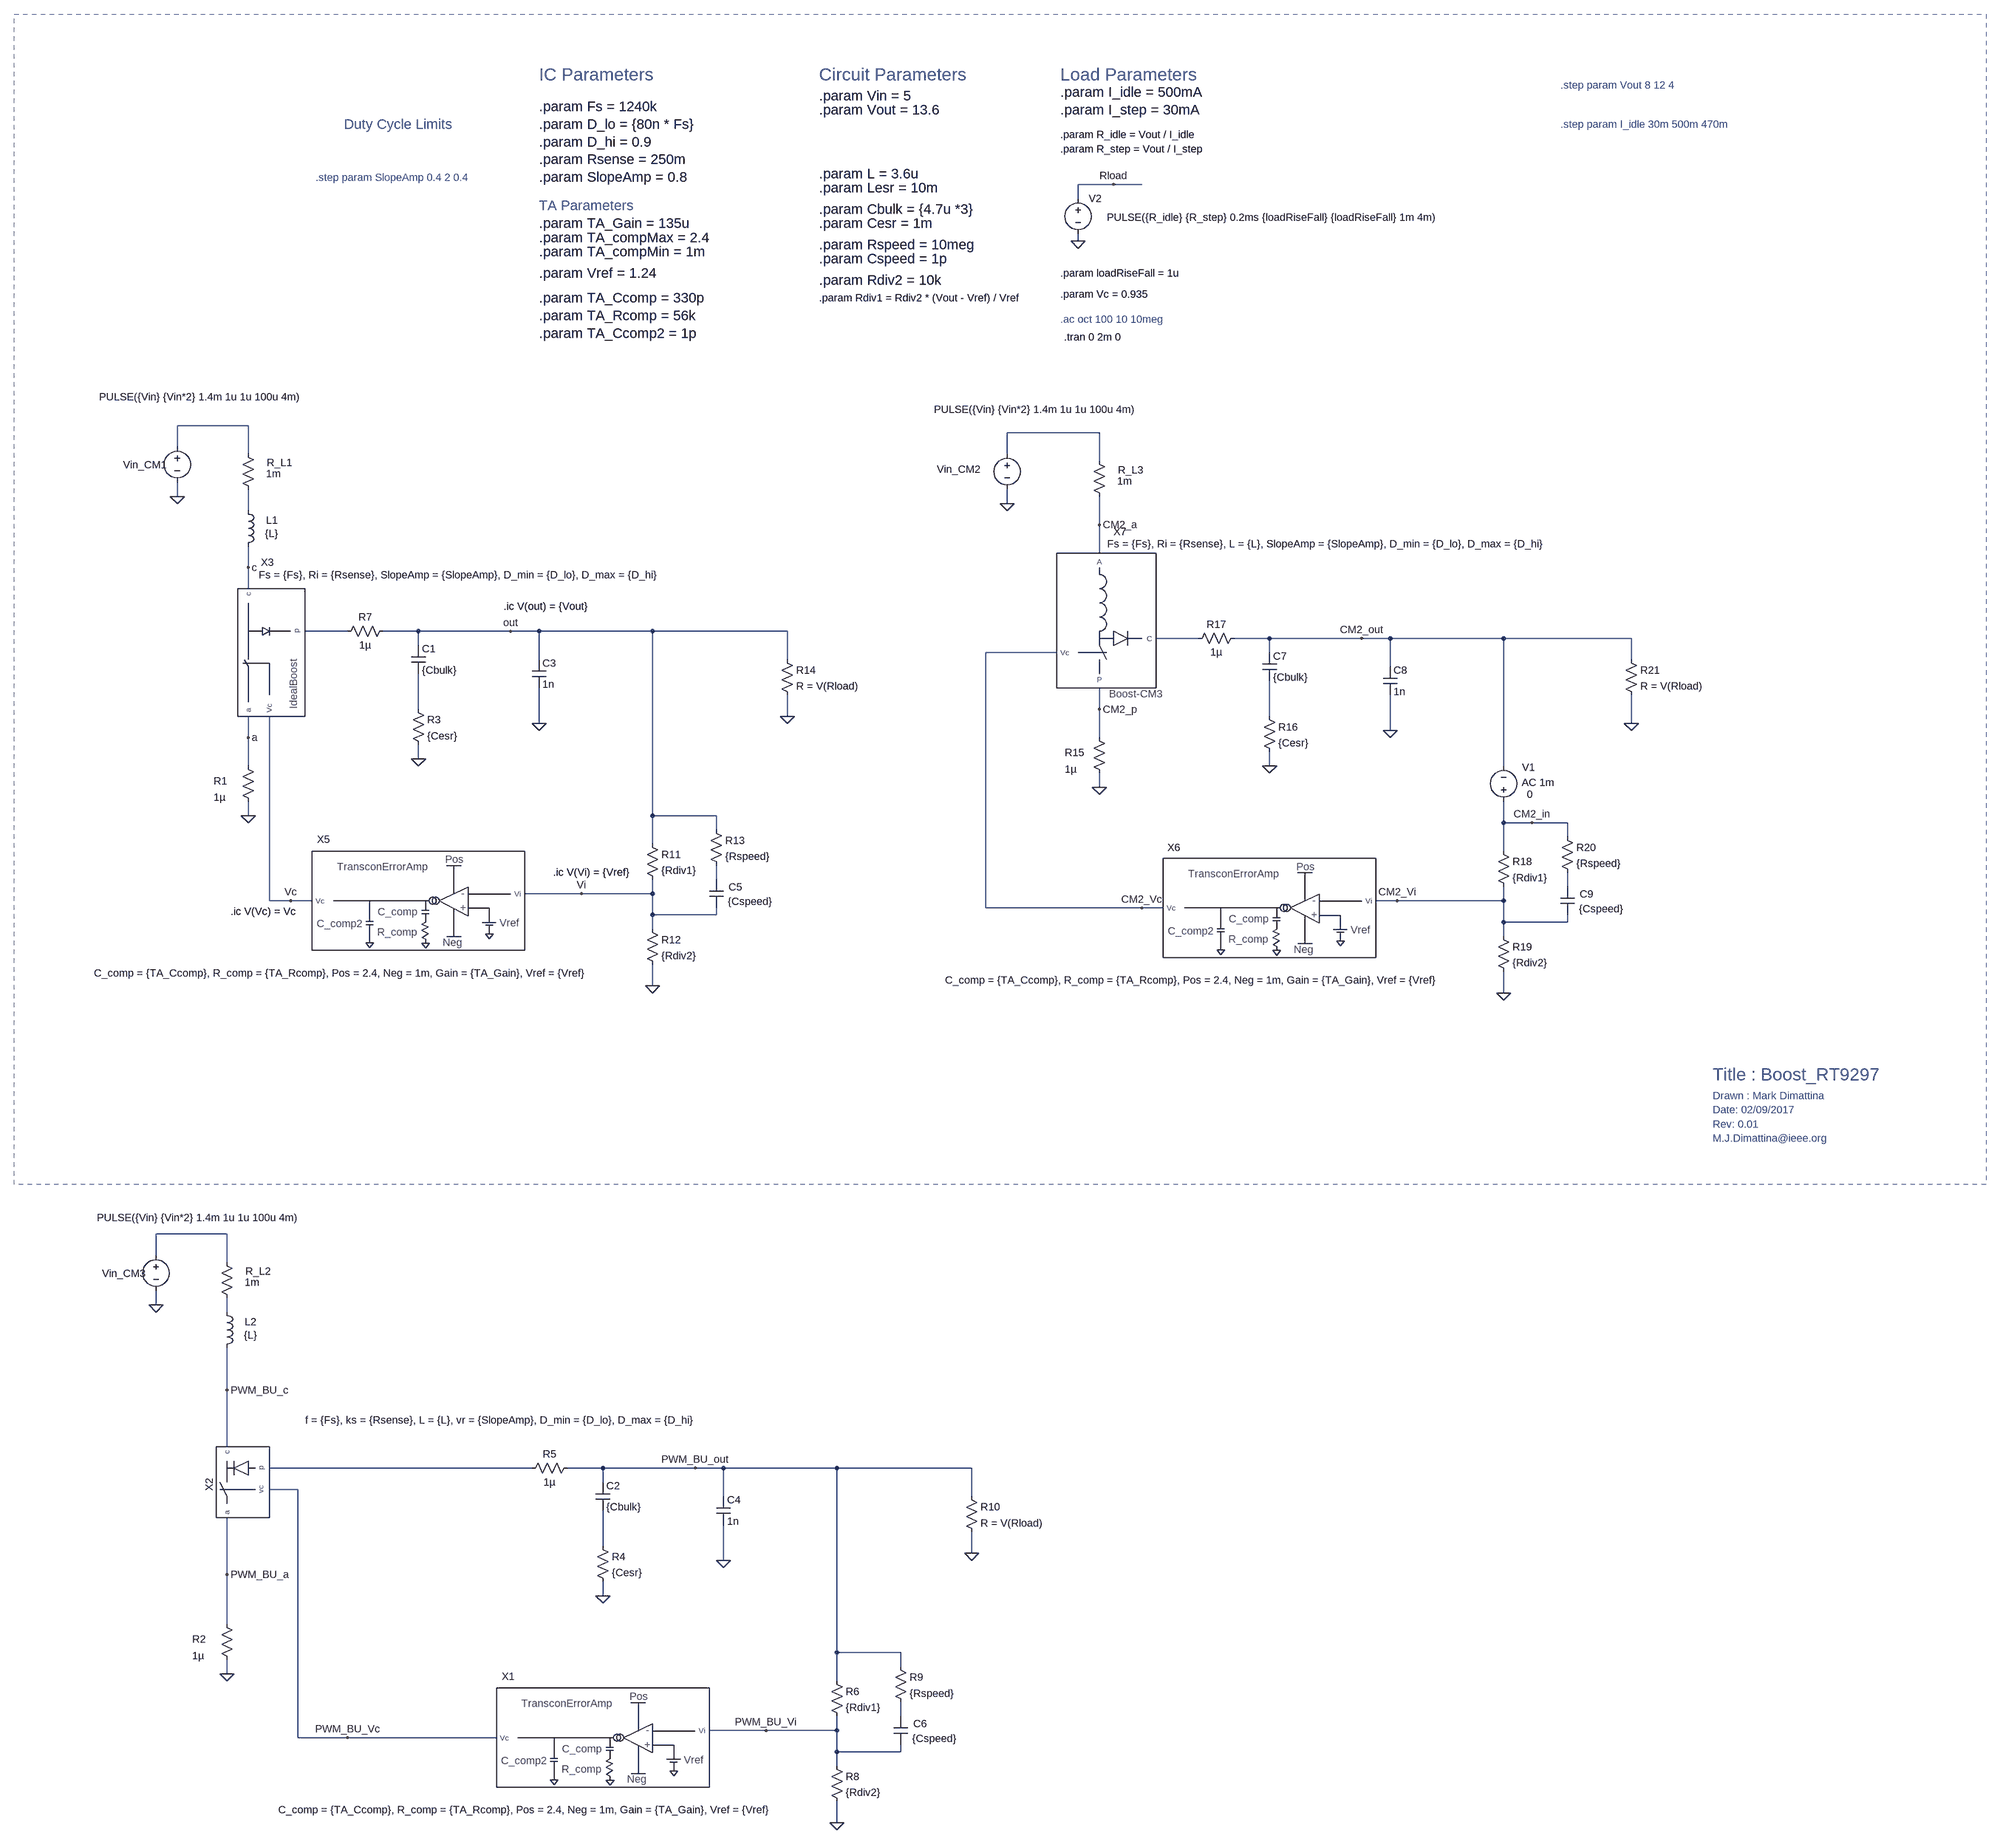
[diagram p0: schematic Boost_RT9297.asc]
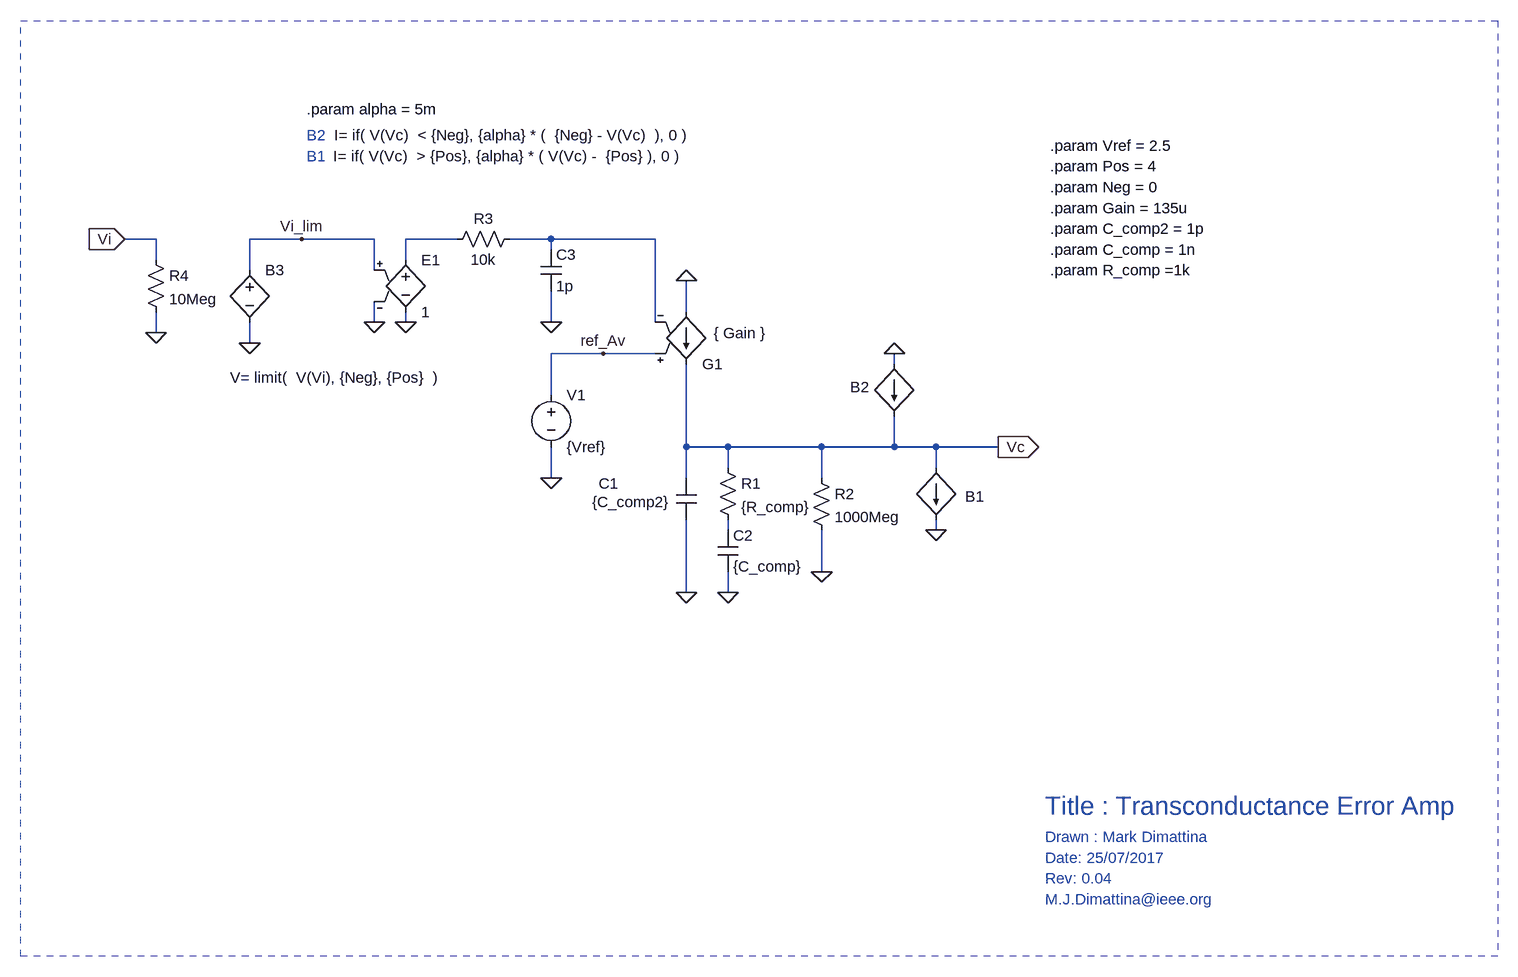
[diagram p1: sub-circuit transconerroramp.asc]
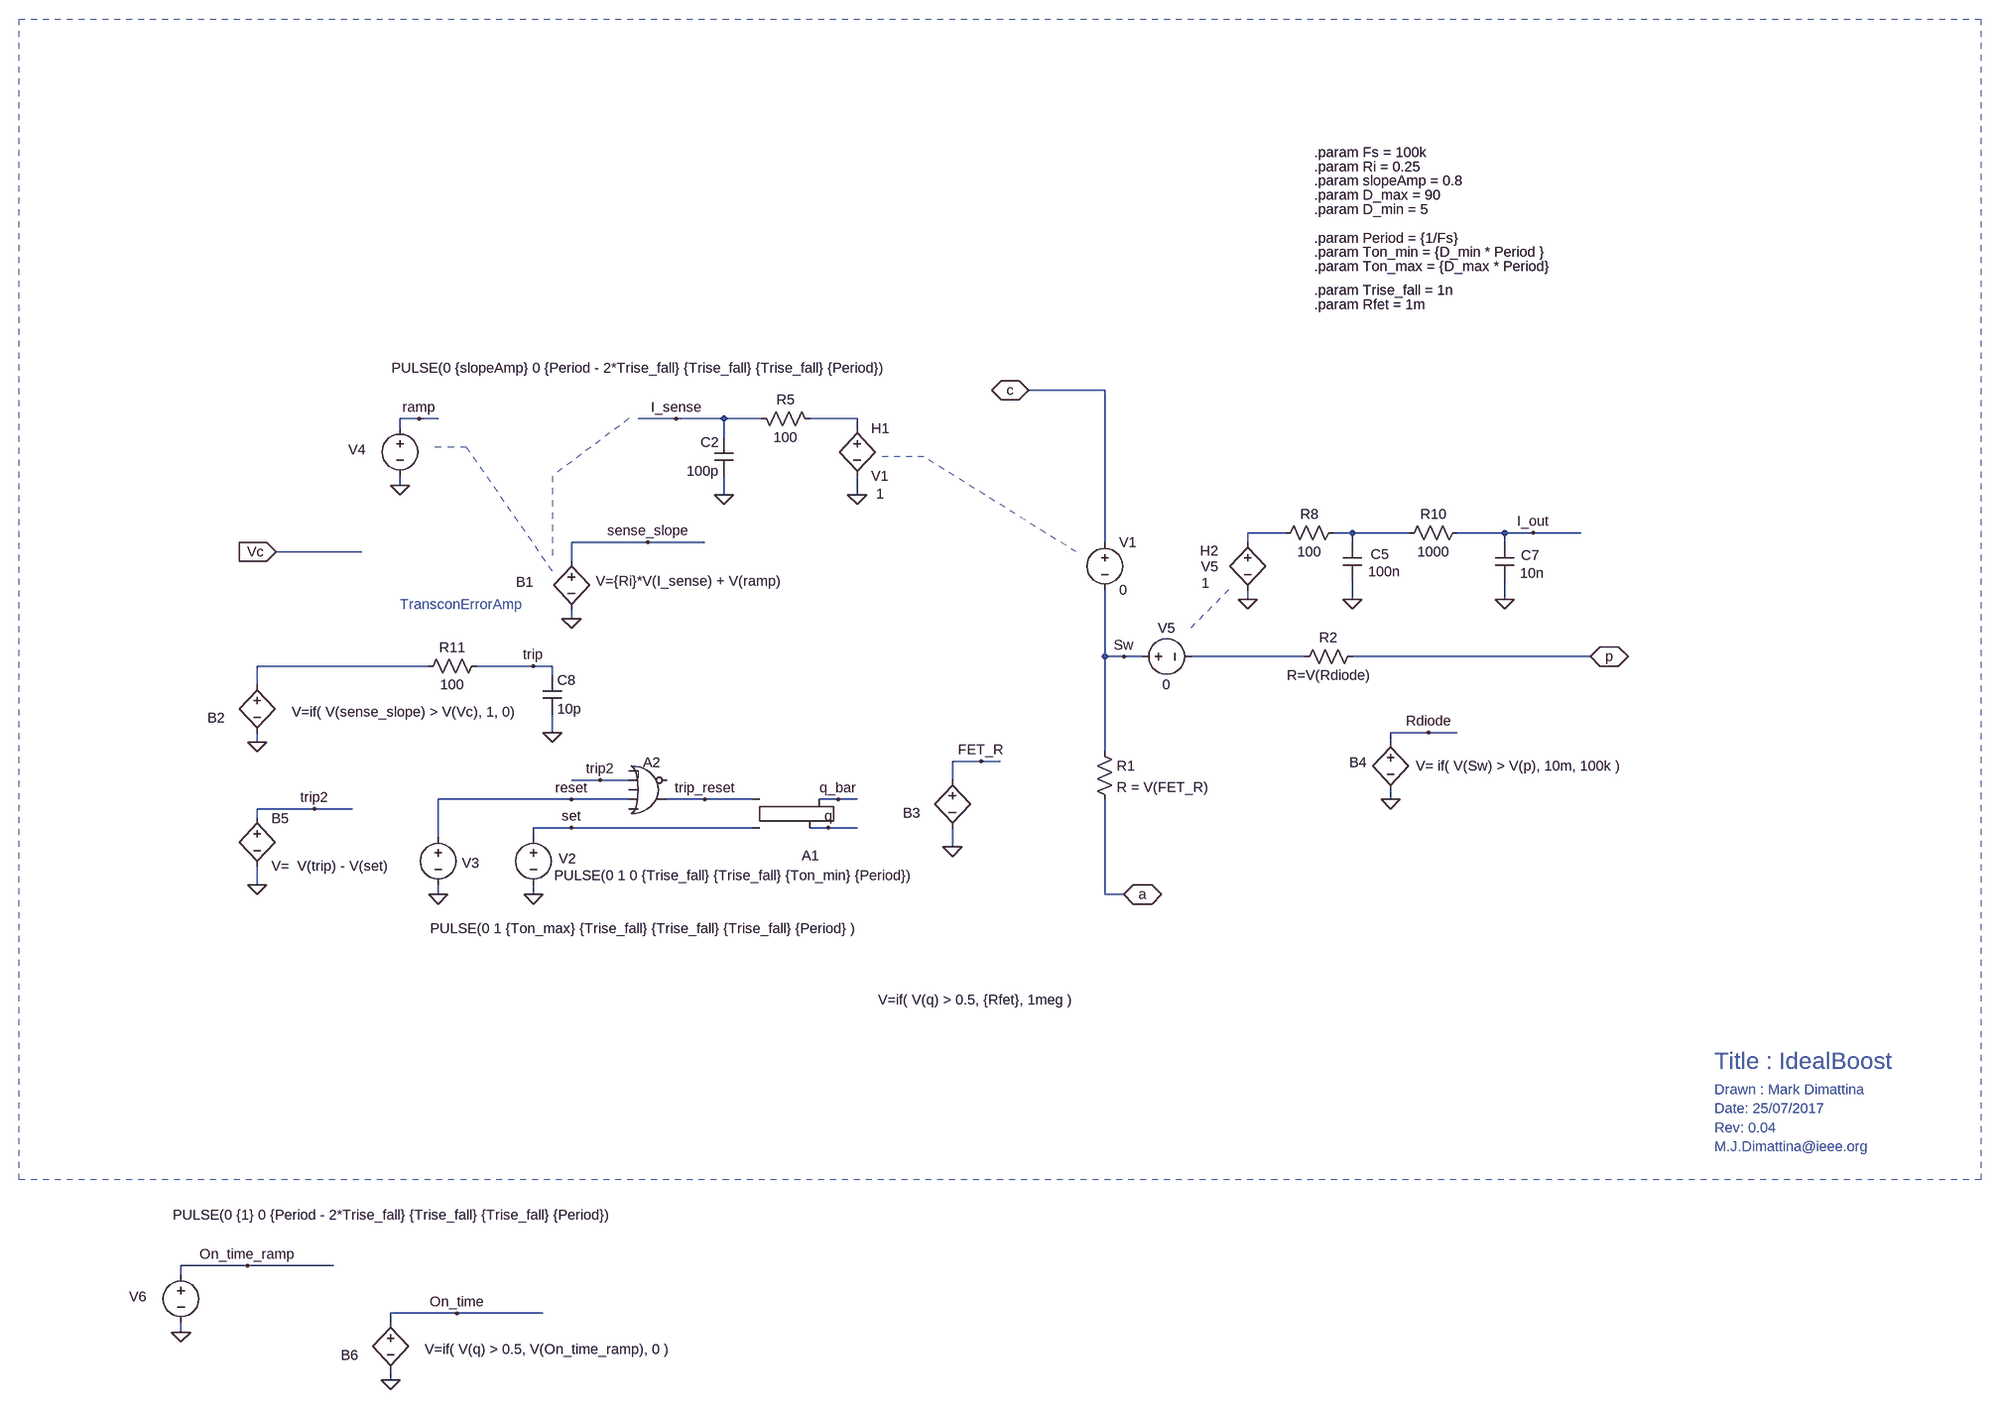
[diagram p2: sub-circuit idealboost.asc]
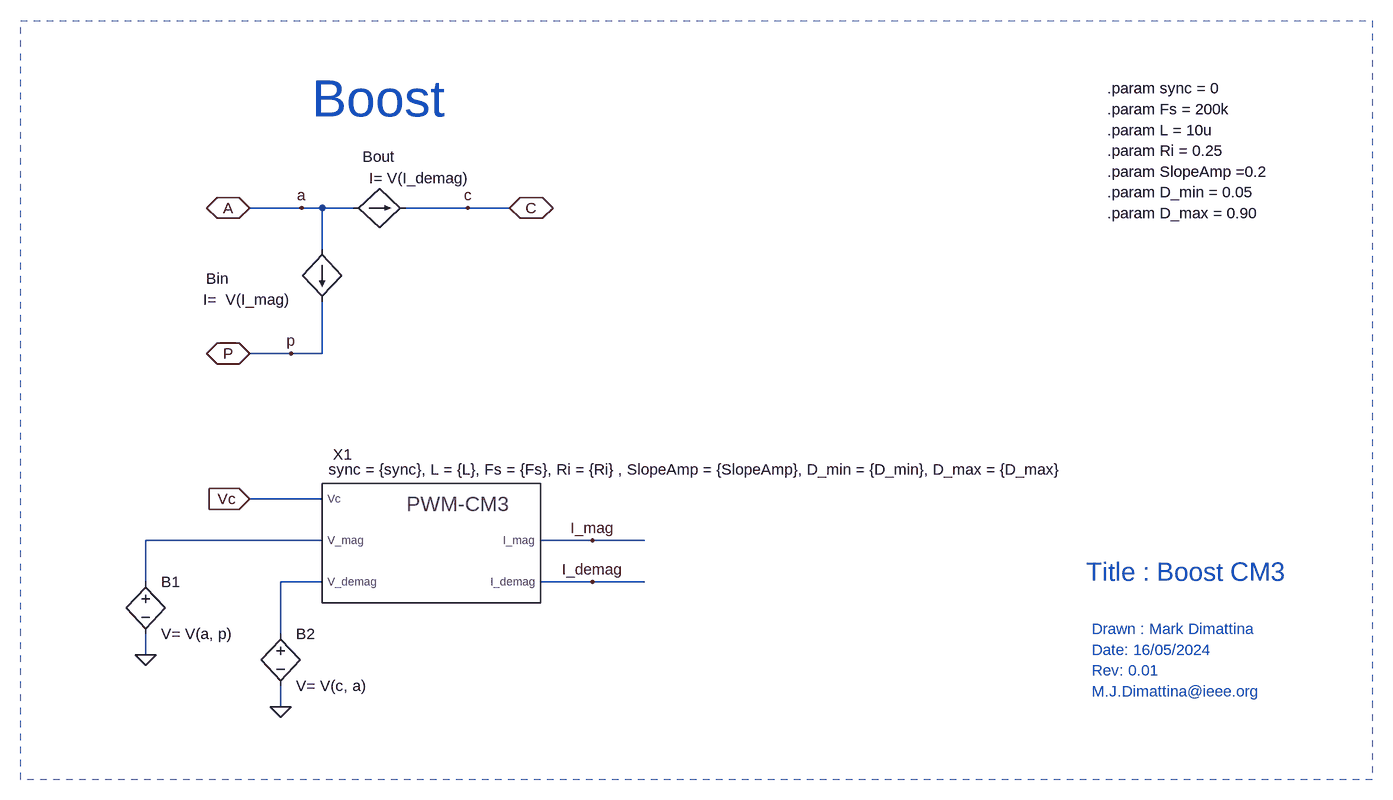
[diagram p3: sub-circuit boost_cm3.asc]
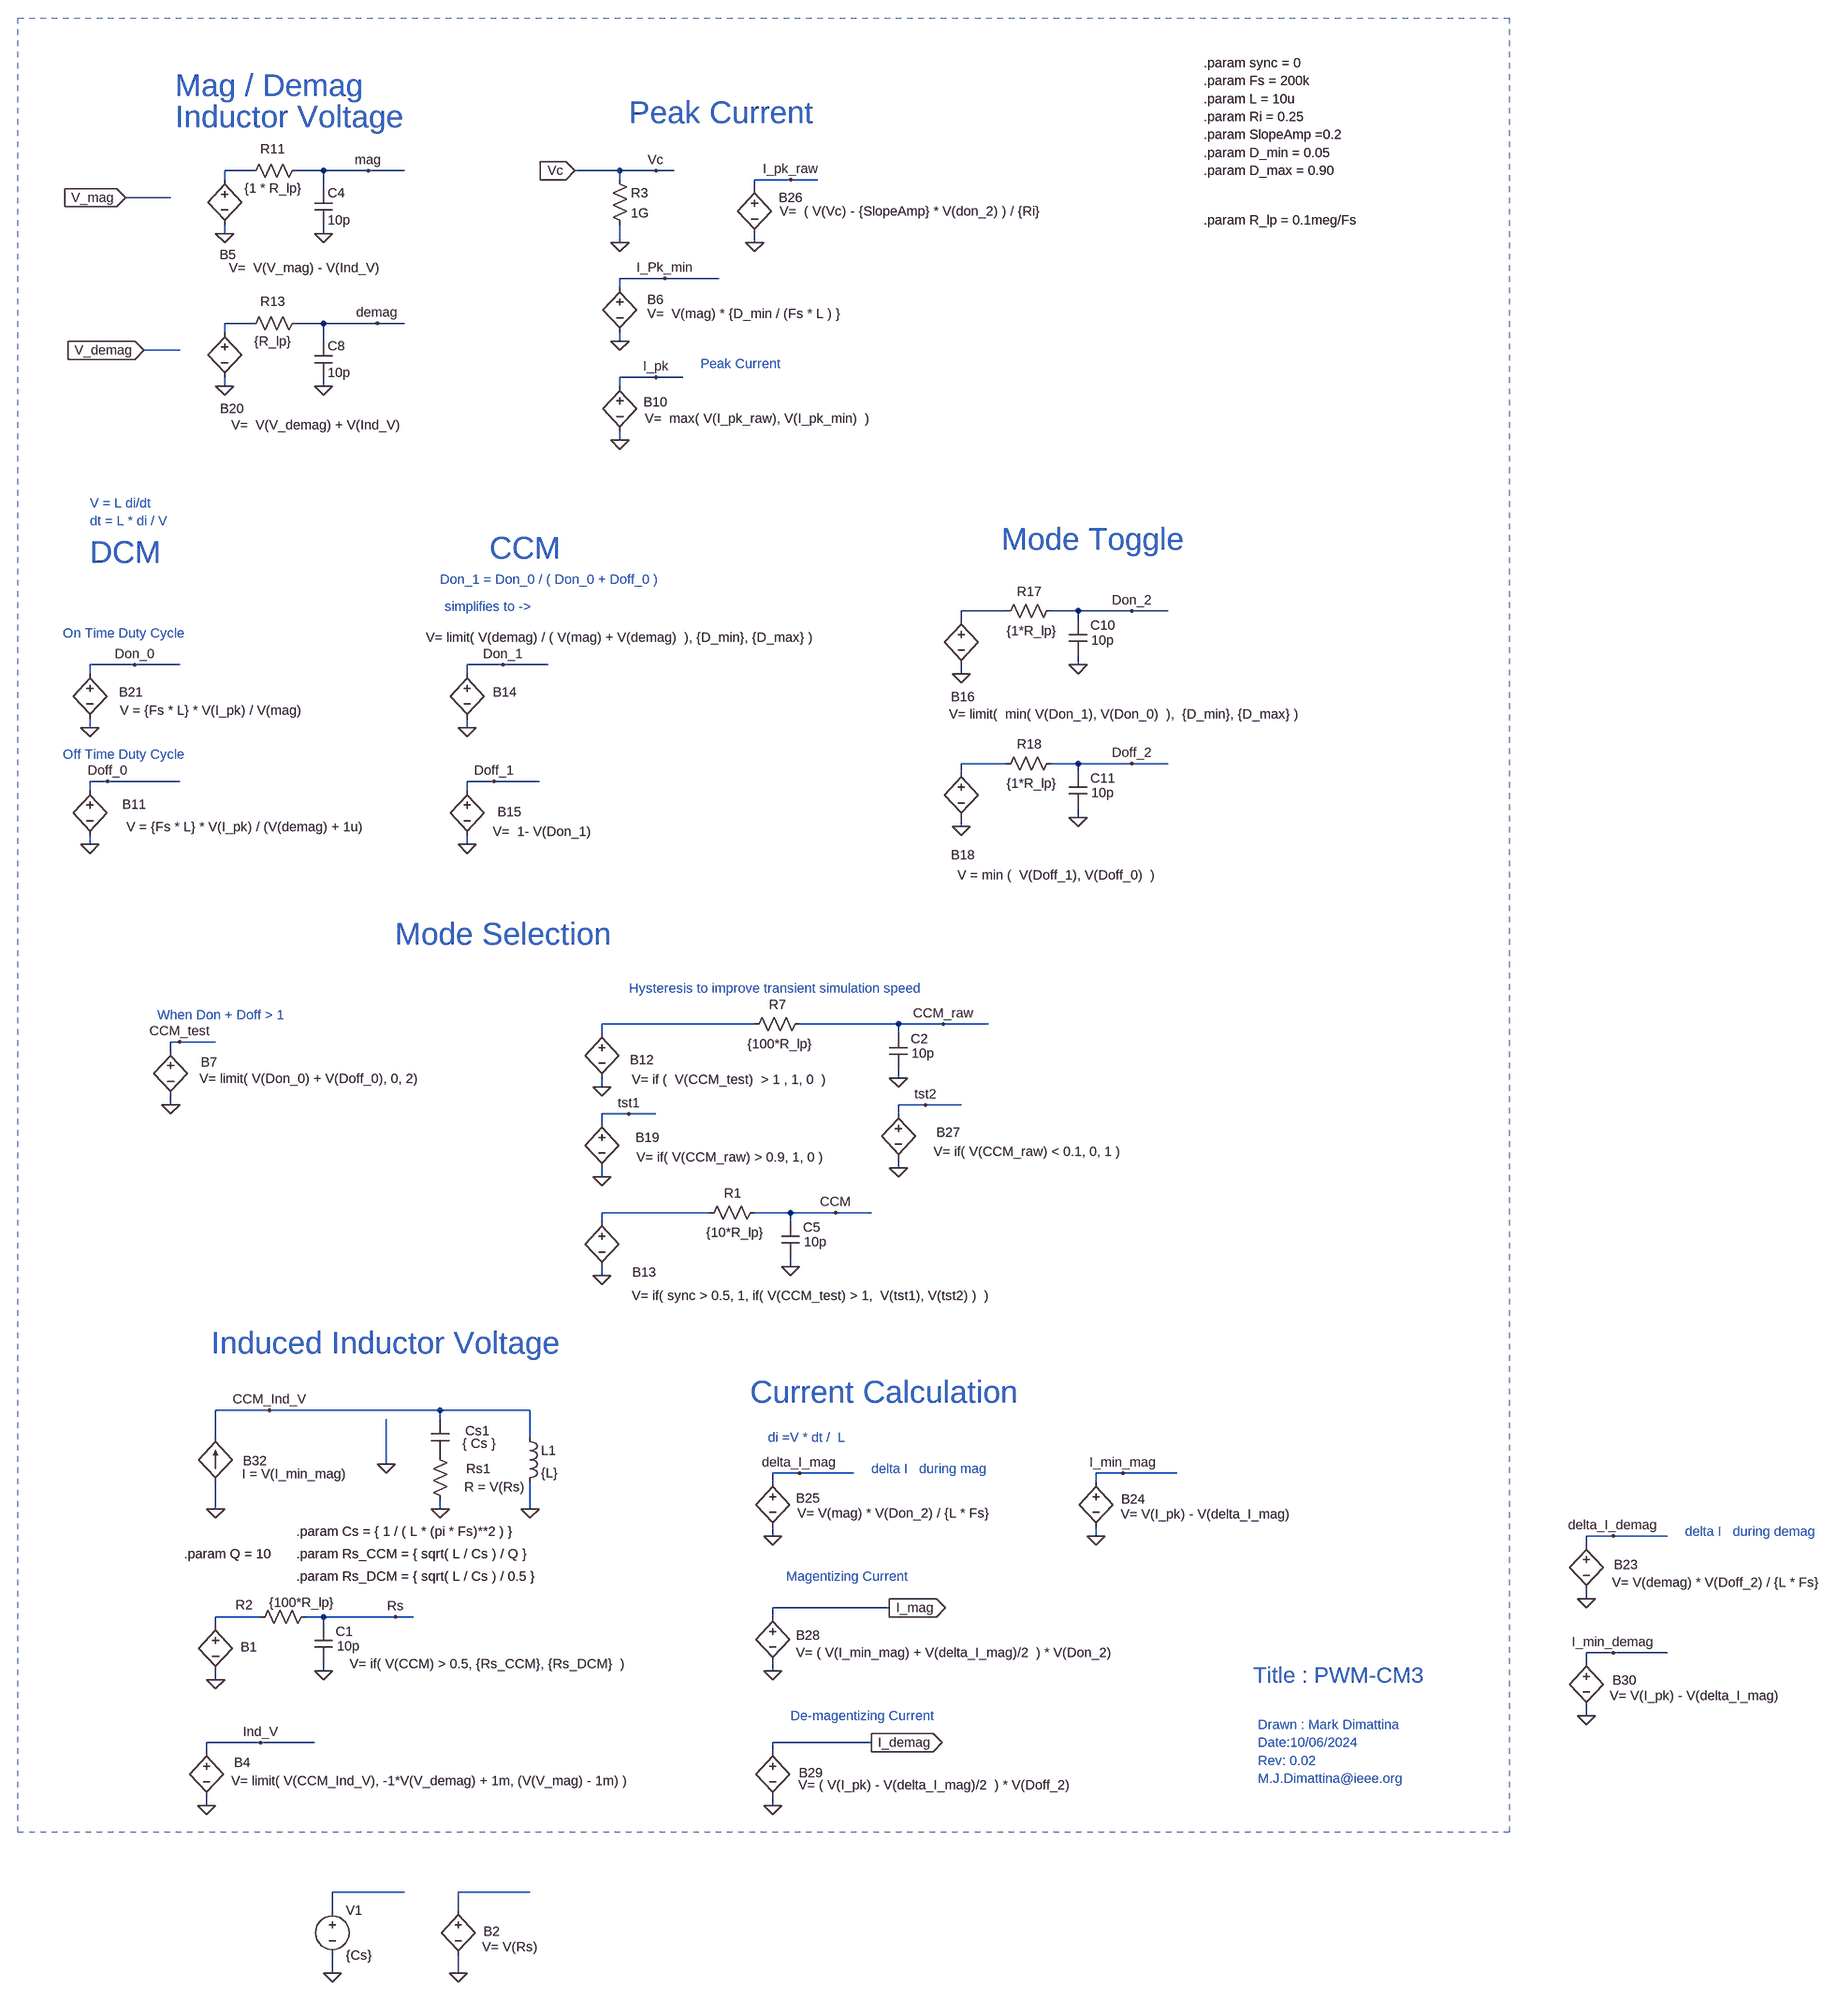
[diagram p4: sub-circuit pwm_cm3.asc]
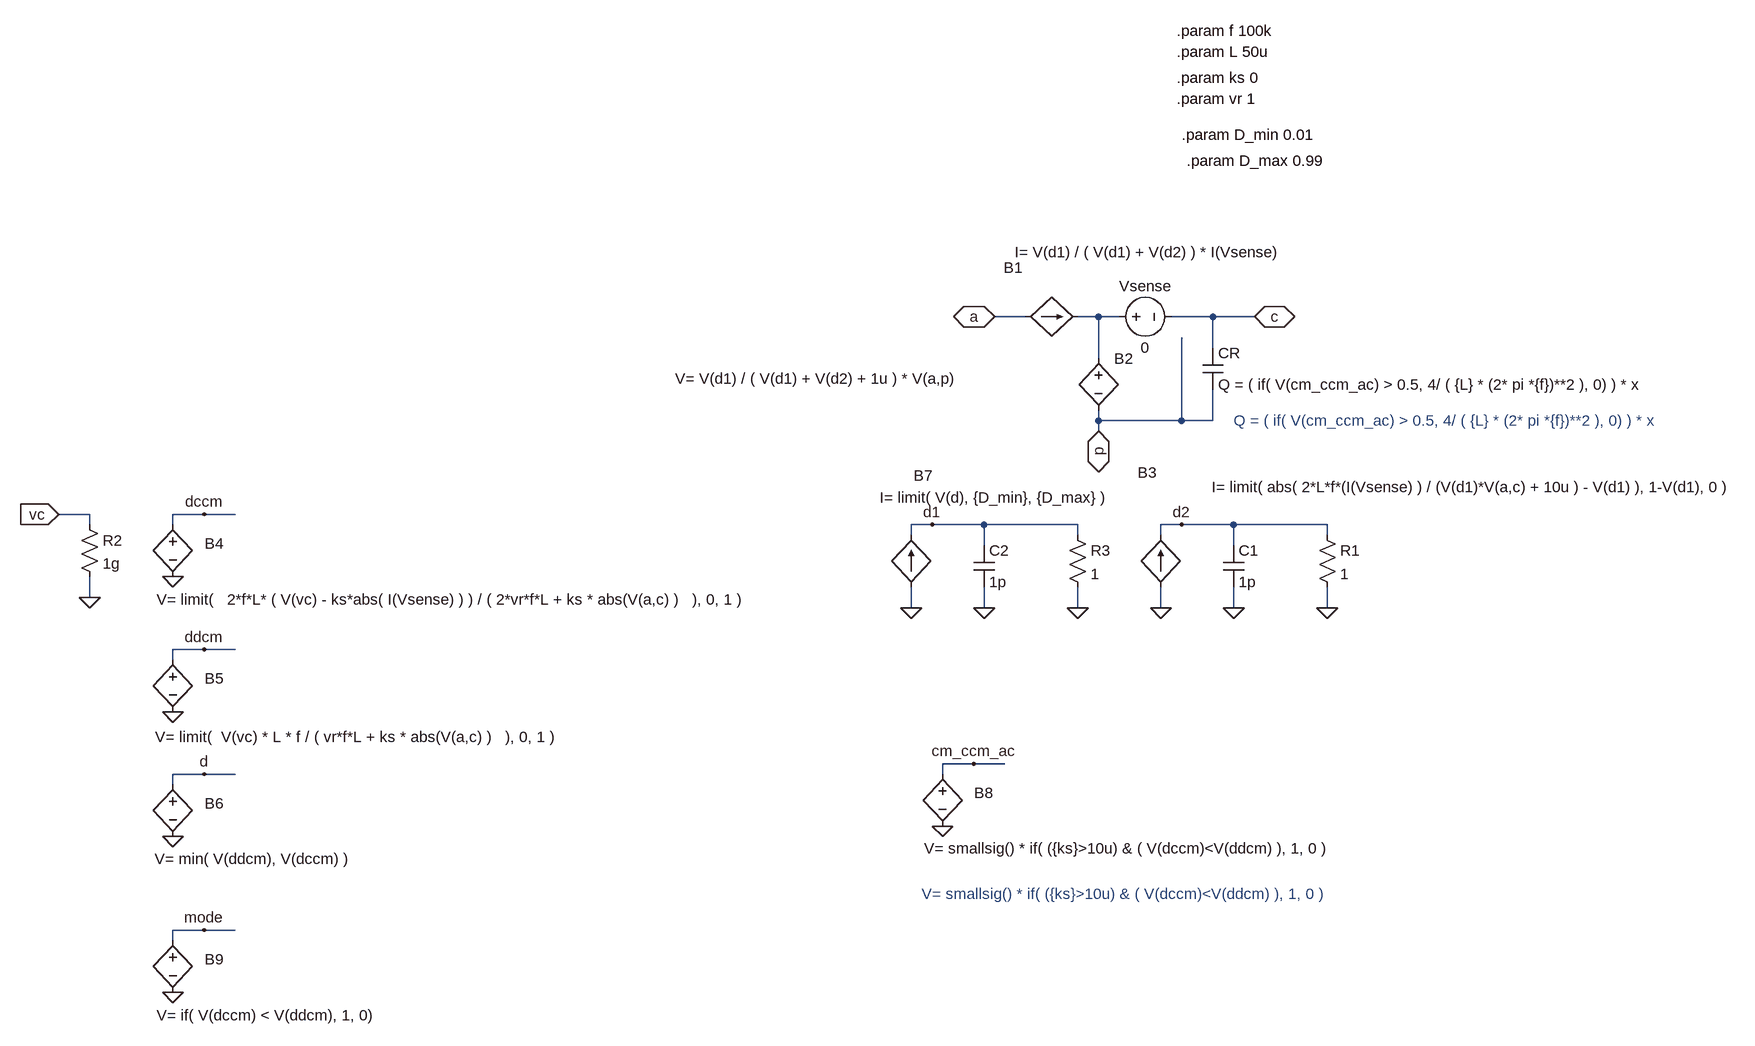
[diagram p5: sub-circuit pwm_bu.asc]
Boost_RT9297.asc, the LTspice schematic file:
Version 4
SHEET 1 4164 4132
WIRE 784 -416 704 -416
WIRE 848 -416 784 -416
WIRE 704 -384 704 -416
WIRE 704 -288 704 -304
WIRE -1168 128 -1328 128
WIRE 752 144 544 144
WIRE -1328 176 -1328 128
WIRE -1168 192 -1168 128
WIRE 544 192 544 144
WIRE 752 208 752 144
WIRE -1328 288 -1328 256
WIRE 544 304 544 272
WIRE -1168 320 -1168 272
WIRE 752 352 752 288
WIRE 752 416 752 352
WIRE -1168 448 -1168 400
WIRE -1168 496 -1168 448
WIRE -944 592 -1040 592
WIRE -784 592 -864 592
WIRE -576 592 -784 592
WIRE -512 592 -576 592
WIRE -256 592 -512 592
WIRE 48 592 -256 592
WIRE 976 608 880 608
WIRE 1136 608 1056 608
WIRE 1344 608 1136 608
WIRE 1408 608 1344 608
WIRE 1664 608 1408 608
WIRE 1952 608 1664 608
WIRE -784 624 -784 592
WIRE 656 640 496 640
WIRE 1136 640 1136 608
WIRE -512 656 -512 592
WIRE 48 656 48 592
WIRE 1952 656 1952 608
WIRE 1408 672 1408 608
WIRE -784 768 -784 688
WIRE 752 768 752 720
WIRE 48 784 48 736
WIRE 1136 784 1136 704
WIRE -512 800 -512 720
WIRE 1952 800 1952 736
WIRE 1408 816 1408 736
WIRE -1168 832 -1168 784
WIRE 752 832 752 768
WIRE -784 880 -784 848
WIRE -1168 896 -1168 832
WIRE 1136 896 1136 864
WIRE 1664 896 1664 608
WIRE 752 944 752 912
WIRE -1168 1008 -1168 976
WIRE -256 1008 -256 592
WIRE -112 1008 -256 1008
WIRE 1664 1024 1664 976
WIRE 1728 1024 1664 1024
WIRE 1808 1024 1728 1024
WIRE -112 1040 -112 1008
WIRE 1808 1056 1808 1024
WIRE -256 1072 -256 1008
WIRE 1664 1088 1664 1024
WIRE -112 1152 -112 1120
WIRE 1808 1168 1808 1136
WIRE -416 1184 -544 1184
WIRE -256 1184 -256 1152
WIRE -256 1184 -416 1184
WIRE -1120 1200 -1120 784
WIRE -1072 1200 -1120 1200
WIRE -1024 1200 -1072 1200
WIRE 1424 1200 1376 1200
WIRE 1664 1200 1664 1168
WIRE 1664 1200 1424 1200
WIRE 496 1216 496 640
WIRE 848 1216 496 1216
WIRE 896 1216 848 1216
WIRE -256 1232 -256 1184
WIRE -112 1232 -112 1216
WIRE -112 1232 -256 1232
WIRE 1664 1248 1664 1200
WIRE 1808 1248 1808 1232
WIRE 1808 1248 1664 1248
WIRE -256 1264 -256 1232
WIRE 1664 1280 1664 1248
WIRE -256 1392 -256 1344
WIRE 1664 1408 1664 1360
WIRE -1216 1952 -1376 1952
WIRE -1376 2000 -1376 1952
WIRE -1216 2016 -1216 1952
WIRE -1376 2112 -1376 2080
WIRE -1216 2128 -1216 2096
WIRE -1216 2304 -1216 2208
WIRE -1216 2432 -1216 2304
WIRE -528 2480 -1120 2480
WIRE -368 2480 -448 2480
WIRE -160 2480 -368 2480
WIRE -96 2480 -160 2480
WIRE 160 2480 -96 2480
WIRE 464 2480 160 2480
WIRE -368 2512 -368 2480
WIRE -1056 2528 -1120 2528
WIRE -96 2544 -96 2480
WIRE 464 2544 464 2480
WIRE -368 2656 -368 2576
WIRE 464 2672 464 2624
WIRE -96 2688 -96 2608
WIRE -1216 2720 -1216 2592
WIRE -368 2768 -368 2736
WIRE -1216 2832 -1216 2720
WIRE 160 2896 160 2480
WIRE 304 2896 160 2896
WIRE 304 2928 304 2896
WIRE -1216 2944 -1216 2912
WIRE 160 2960 160 2896
WIRE 304 3040 304 3008
WIRE 0 3072 -128 3072
WIRE 160 3072 160 3040
WIRE 160 3072 0 3072
WIRE -1056 3088 -1056 2528
WIRE -944 3088 -1056 3088
WIRE -608 3088 -944 3088
WIRE 160 3120 160 3072
WIRE 304 3120 304 3104
WIRE 304 3120 160 3120
WIRE 160 3152 160 3120
WIRE 160 3280 160 3232
FLAG 704 -288 0
FLAG 784 -416 Rload
FLAG -576 592 out
FLAG -1168 1008 0
FLAG -1072 1200 Vc
FLAG -1328 288 0
FLAG -784 880 0
FLAG -1168 832 a
FLAG -1168 448 c
FLAG -512 800 0
FLAG -256 1392 0
FLAG 48 784 0
FLAG -416 1184 Vi
FLAG 1344 608 CM2_out
FLAG 752 944 0
FLAG 848 1216 CM2_Vc
FLAG 544 304 0
FLAG 1136 896 0
FLAG 752 768 CM2_p
FLAG 752 352 CM2_a
FLAG 1408 816 0
FLAG 1664 1408 0
FLAG 1728 1024 CM2_in
FLAG 1952 800 0
FLAG 1424 1200 CM2_Vi
FLAG -160 2480 PWM_BU_out
FLAG -1216 2944 0
FLAG -944 3088 PWM_BU_Vc
FLAG -1376 2112 0
FLAG -368 2768 0
FLAG -1216 2720 PWM_BU_a
FLAG -1216 2304 PWM_BU_c
FLAG -96 2688 0
FLAG 160 3280 0
FLAG 464 2672 0
FLAG 0 3072 PWM_BU_Vi
DATAFLAG 624 1216 ""
DATAFLAG 1792 608 ""
DATAFLAG -736 3088 ""
DATAFLAG 48 2480 ""
SYMBOL voltage 704 -400 R0
WINDOW 3 65 58 Left 2
WINDOW 123 0 0 Left 2
WINDOW 39 0 0 Left 2
SYMATTR Value PULSE({R_idle} {R_step} 0.2ms {loadRiseFall} {loadRiseFall} 1m 4m)
SYMATTR InstName V2
SYMBOL res -1184 880 R0
WINDOW 0 -62 50 Left 2
WINDOW 3 -62 87 Left 2
SYMATTR InstName R1
SYMATTR Value 1µ
SYMBOL ind -1184 304 R0
WINDOW 0 56 38 Left 2
WINDOW 3 54 68 Left 2
SYMATTR InstName L1
SYMATTR Value {L}
SYMBOL res -1184 176 R0
WINDOW 0 58 36 Left 2
WINDOW 3 56 61 Left 2
SYMATTR InstName R_L1
SYMATTR Value 1m
SYMBOL voltage -1328 160 R0
WINDOW 0 -122 57 Left 2
WINDOW 3 -176 -97 Left 2
WINDOW 123 0 0 Left 0
WINDOW 39 0 0 Left 0
SYMATTR InstName Vin_CM1
SYMATTR Value PULSE({Vin} {Vin*2} 1.4m 1u 1u 100u 4m)
SYMBOL cap -800 624 R0
SYMATTR InstName C1
SYMATTR Value {Cbulk}
SYMBOL res -800 752 R0
SYMATTR InstName R3
SYMATTR Value {Cesr}
SYMBOL res -960 608 R270
WINDOW 0 32 56 VTop 2
WINDOW 3 0 56 VBottom 2
SYMATTR InstName R7
SYMATTR Value 1µ
SYMBOL cap -528 656 R0
SYMATTR InstName C3
SYMATTR Value 1n
SYMBOL res -272 1056 R0
SYMATTR InstName R11
SYMATTR Value {Rdiv1}
SYMBOL res -272 1248 R0
SYMATTR InstName R12
SYMATTR Value {Rdiv2}
SYMBOL res -128 1024 R0
SYMATTR InstName R13
SYMATTR Value {Rspeed}
SYMBOL cap -128 1152 R0
WINDOW 0 44 17 Left 2
WINDOW 3 42 50 Left 2
SYMATTR InstName C5
SYMATTR Value {Cspeed}
SYMBOL res 32 640 R0
SYMATTR InstName R14
SYMATTR Value R = V(Rload)
SYMBOL TransconErrorAmp -640 1120 M0
WINDOW 0 343 -58 Left 2
WINDOW 39 -233 243 Left 2
SYMATTR InstName X5
SYMATTR SpiceLine C_comp = {TA_Ccomp}, R_comp = {TA_Rcomp}, Pos = 2.4, Neg = 1m, Gain = {TA_Gain}, Vref = {Vref}
SYMBOL IdealBoost -1136 688 R270
WINDOW 39 223 -8 VRight 2
WINDOW 0 236 11 VTop 2
SYMATTR SpiceLine Fs = {Fs}, Ri = {Rsense}, SlopeAmp = {SlopeAmp}, D_min = {D_lo}, D_max = {D_hi}
SYMATTR InstName X3
SYMBOL res 736 816 R0
WINDOW 0 -62 50 Left 2
WINDOW 3 -62 87 Left 2
SYMATTR InstName R15
SYMATTR Value 1µ
SYMBOL res 736 192 R0
WINDOW 0 58 36 Left 2
WINDOW 3 56 61 Left 2
SYMATTR InstName R_L3
SYMATTR Value 1m
SYMBOL voltage 544 176 R0
WINDOW 0 -158 51 Left 2
WINDOW 3 -165 -84 Left 2
SYMATTR InstName Vin_CM2
SYMATTR Value PULSE({Vin} {Vin*2} 1.4m 1u 1u 100u 4m)
SYMBOL cap 1120 640 R0
SYMATTR InstName C7
SYMATTR Value {Cbulk}
SYMBOL res 1120 768 R0
SYMATTR InstName R16
SYMATTR Value {Cesr}
SYMBOL res 960 624 R270
WINDOW 0 32 56 VTop 2
WINDOW 3 0 56 VBottom 2
SYMATTR InstName R17
SYMATTR Value 1µ
SYMBOL cap 1392 672 R0
SYMATTR InstName C8
SYMATTR Value 1n
SYMBOL res 1648 1072 R0
SYMATTR InstName R18
SYMATTR Value {Rdiv1}
SYMBOL res 1648 1264 R0
SYMATTR InstName R19
SYMATTR Value {Rdiv2}
SYMBOL res 1792 1040 R0
SYMATTR InstName R20
SYMATTR Value {Rspeed}
SYMBOL cap 1792 1168 R0
WINDOW 0 44 17 Left 2
WINDOW 3 42 50 Left 2
SYMATTR InstName C9
SYMATTR Value {Cspeed}
SYMBOL voltage 1664 992 R180
WINDOW 0 -71 93 Left 2
WINDOW 3 -66 32 Left 2
WINDOW 123 -114 59 Left 2
WINDOW 39 0 0 Left 2
SYMATTR InstName V1
SYMATTR Value 0
SYMATTR Value2 AC 1m
SYMBOL res 1936 640 R0
SYMATTR InstName R21
SYMATTR Value R = V(Rload)
SYMBOL TransconErrorAmp 1280 1136 M0
WINDOW 0 345 -56 Left 2
WINDOW 39 -233 243 Left 2
SYMATTR InstName X6
SYMATTR SpiceLine C_comp = {TA_Ccomp}, R_comp = {TA_Rcomp}, Pos = 2.4, Neg = 1m, Gain = {TA_Gain}, Vref = {Vref}
SYMBOL Boost_CM3 688 496 R0
WINDOW 0 111 -113 Bottom 2
WINDOW 39 82 -101 Left 2
SYMATTR InstName X7
SYMATTR SpiceLine Fs = {Fs}, Ri = {Rsense}, L = {L}, SlopeAmp = {SlopeAmp}, D_min = {D_lo}, D_max = {D_hi}
SYMBOL res -1232 2816 R0
WINDOW 0 -62 50 Left 2
WINDOW 3 -62 87 Left 2
SYMATTR InstName R2
SYMATTR Value 1µ
SYMBOL ind -1232 2112 R0
WINDOW 0 56 38 Left 2
WINDOW 3 54 68 Left 2
SYMATTR InstName L2
SYMATTR Value {L}
SYMBOL res -1232 2000 R0
WINDOW 0 58 36 Left 2
WINDOW 3 56 61 Left 2
SYMATTR InstName R_L2
SYMATTR Value 1m
SYMBOL voltage -1376 1984 R0
WINDOW 0 -122 57 Left 2
WINDOW 3 -133 -69 Left 2
SYMATTR InstName Vin_CM3
SYMATTR Value PULSE({Vin} {Vin*2} 1.4m 1u 1u 100u 4m)
SYMBOL cap -384 2512 R0
SYMATTR InstName C2
SYMATTR Value {Cbulk}
SYMBOL res -384 2640 R0
SYMATTR InstName R4
SYMATTR Value {Cesr}
SYMBOL res -544 2496 R270
WINDOW 0 32 56 VTop 2
WINDOW 3 0 56 VBottom 2
SYMATTR InstName R5
SYMATTR Value 1µ
SYMBOL cap -112 2544 R0
SYMATTR InstName C4
SYMATTR Value 1n
SYMBOL res 144 2944 R0
SYMATTR InstName R6
SYMATTR Value {Rdiv1}
SYMBOL res 144 3136 R0
SYMATTR InstName R8
SYMATTR Value {Rdiv2}
SYMBOL res 288 2912 R0
SYMATTR InstName R9
SYMATTR Value {Rspeed}
SYMBOL cap 288 3040 R0
WINDOW 0 44 17 Left 2
WINDOW 3 42 50 Left 2
SYMATTR InstName C6
SYMATTR Value {Cspeed}
SYMBOL res 448 2528 R0
SYMATTR InstName R10
SYMATTR Value R = V(Rload)
SYMBOL TransconErrorAmp -224 3008 M0
WINDOW 0 343 -58 Left 2
WINDOW 39 -233 243 Left 2
SYMATTR InstName X1
SYMATTR SpiceLine C_comp = {TA_Ccomp}, R_comp = {TA_Rcomp}, Pos = 2.4, Neg = 1m, Gain = {TA_Gain}, Vref = {Vref}
SYMBOL PWM_BU -1184 2544 R270
WINDOW 39 157 583 VTop 2
SYMATTR InstName X2
SYMATTR SpiceLine f = {Fs}, ks = {Rsense}, L = {L}, vr = {SlopeAmp}, D_min = {D_lo}, D_max = {D_hi}
TEXT 664 -112 Left 2 ;.ac oct 100 10 10meg
TEXT 120 -440 Left 3 !.param L = 3.6u
TEXT -512 -592 Left 3 !.param Fs = 1240k
TEXT -512 -552 Left 3 !.param D_lo = {80n * Fs}
TEXT -512 -512 Left 3 !.param D_hi = 0.9
TEXT -512 -432 Left 3 !.param SlopeAmp = 0.8
TEXT -704 -552 Right 3 ;Duty Cycle Limits
TEXT -512 -664 Left 4 ;IC Parameters
TEXT 120 -584 Left 3 !.param Vout = 13.6
TEXT 120 -360 Left 3 !.param Cbulk = {4.7u *3}
TEXT 120 -328 Left 3 !.param Cesr = 1m
TEXT 120 -616 Left 3 !.param Vin = 5
TEXT 120 -408 Left 3 !.param Lesr = 10m
TEXT -512 -472 Left 3 !.param Rsense = 250m
TEXT 120 -200 Left 3 !.param Rdiv2 = 10k
TEXT 120 -160 Left 2 !.param Rdiv1 = Rdiv2 * (Vout - Vref) / Vref
TEXT -512 -216 Left 3 !.param Vref = 1.24
TEXT -512 -368 Left 3 ;TA Parameters
TEXT -512 -120 Left 3 !.param TA_Rcomp = 56k
TEXT -512 -160 Left 3 !.param TA_Ccomp = 330p
TEXT -512 -80 Left 3 !.param TA_Ccomp2 = 1p
TEXT -512 -328 Left 3 !.param TA_Gain = 135u
TEXT -512 -296 Left 3 !.param TA_compMax = 2.4
TEXT -512 -264 Left 3 !.param TA_compMin = 1m
TEXT 664 -584 Left 3 !.param I_step = 30mA
TEXT 664 -624 Left 3 !.param I_idle = 500mA
TEXT 664 -528 Left 2 !.param R_idle = Vout / I_idle
TEXT 664 -216 Left 2 !.param loadRiseFall = 1u
TEXT 120 -280 Left 3 !.param Rspeed = 10meg
TEXT 120 -248 Left 3 !.param Cspeed = 1p
TEXT 664 -168 Left 2 !.param Vc = 0.935
TEXT 120 -664 Left 4 ;Circuit Parameters
TEXT 664 -496 Left 2 !.param R_step = Vout / I_step
TEXT -592 536 Left 2 !.ic V(out) = {Vout}
TEXT -480 1136 Left 2 !.ic V(Vi) = {Vref}
TEXT 664 -664 Left 4 ;Load Parameters
TEXT -1208 1224 Left 2 !.ic V(Vc) = Vc
TEXT 1792 -640 Left 2 ;.step param Vout 8 12 4
TEXT 1792 -552 Left 2 ;.step param I_idle 30m 500m 470m
TEXT 2136 1640 Left 2 ;Drawn : Mark Dimattina
TEXT 2136 1592 Left 4 ;Title : Boost_RT9297
TEXT 2136 1704 Left 2 ;Rev: 0.01
TEXT 2136 1672 Left 2 ;Date: 02/09/2017
TEXT 2136 1736 Left 2 ;M.J.Dimattina@ieee.org
TEXT -1016 -432 Left 2 ;.step param SlopeAmp 0.4 2 0.4
TEXT 672 -72 Left 2 !.tran 0 2m 0
RECTANGLE Normal 2752 1840 -1696 -800 2

The netlist it stands for:
* Boost_RT9297.asc
V2 Rload 0 PULSE({R_idle} {R_step} 0.2ms {loadRiseFall} {loadRiseFall} 1m 4m)
R1 a 0 1µ
L1 N003 c {L}
R_L1 N001 N003 1m
Vin_CM1 N001 0 PULSE({Vin} {Vin*2} 1.4m 1u 1u 100u 4m)
C1 out N006 {Cbulk}
R3 N006 0 {Cesr}
R7 N004 out 1µ
C3 out 0 1n
R11 out Vi {Rdiv1}
R12 Vi 0 {Rdiv2}
R13 out N008 {Rspeed}
C5 N008 Vi {Cspeed}
R14 out 0 R = V(Rload)
XX5 Vi Vc transconerroramp params: C_comp = {TA_Ccomp}, R_comp = {TA_Rcomp}, Pos = 2.4, Neg = 1m, Gain = {TA_Gain}, Vref = {Vref}
XX3 Vc a c N004 idealboost params: Fs = {Fs}, Ri = {Rsense}, SlopeAmp = {SlopeAmp}, D_min = {D_lo}, D_max = {D_hi}
R15 CM2_p 0 1µ
R_L3 N002 CM2_a 1m
Vin_CM2 N002 0 PULSE({Vin} {Vin*2} 1.4m 1u 1u 100u 4m)
C7 CM2_out N007 {Cbulk}
R16 N007 0 {Cesr}
R17 N005 CM2_out 1µ
C8 CM2_out 0 1n
R18 CM2_in CM2_Vi {Rdiv1}
R19 CM2_Vi 0 {Rdiv2}
R20 CM2_in N009 {Rspeed}
C9 N009 CM2_Vi {Cspeed}
V1 CM2_in CM2_out 0 AC 1m
R21 CM2_out 0 R = V(Rload)
XX6 CM2_Vi CM2_Vc transconerroramp params: C_comp = {TA_Ccomp}, R_comp = {TA_Rcomp}, Pos = 2.4, Neg = 1m, Gain = {TA_Gain}, Vref = {Vref}
XX7 CM2_Vc CM2_a N005 CM2_p boost_cm3 params: Fs = {Fs}, Ri = {Rsense}, L = {L}, SlopeAmp = {SlopeAmp}, D_min = {D_lo}, D_max = {D_hi}
R2 PWM_BU_a 0 1µ
L2 N011 PWM_BU_c {L}
R_L2 N010 N011 1m
Vin_CM3 N010 0 PULSE({Vin} {Vin*2} 1.4m 1u 1u 100u 4m)
C2 PWM_BU_out N013 {Cbulk}
R4 N013 0 {Cesr}
R5 N012 PWM_BU_out 1µ
C4 PWM_BU_out 0 1n
R6 PWM_BU_out PWM_BU_Vi {Rdiv1}
R8 PWM_BU_Vi 0 {Rdiv2}
R9 PWM_BU_out N014 {Rspeed}
C6 N014 PWM_BU_Vi {Cspeed}
R10 PWM_BU_out 0 R = V(Rload)
XX1 PWM_BU_Vi PWM_BU_Vc transconerroramp params: C_comp = {TA_Ccomp}, R_comp = {TA_Rcomp}, Pos = 2.4, Neg = 1m, Gain = {TA_Gain}, Vref = {Vref}
XX2 PWM_BU_Vc PWM_BU_a PWM_BU_c N012 pwm_bu params: f = {Fs}, ks = {Rsense}, L = {L}, vr = {SlopeAmp}, D_min = {D_lo}, D_max = {D_hi}

* block symbol definitions
.subckt transconerroramp Vi Vc
G1 0 Vc ref_Av N002 { Gain }
V1 ref_Av 0 {Vref}
C1 Vc 0 {C_comp2}
C2 N003 0 {C_comp}
R1 Vc N003 {R_comp}
B1 Vc 0 I= if( V(Vc)  > {Pos}, {alpha} * ( V(Vc) -  {Pos} ), 0 )
B2 0 Vc I= if( V(Vc)  < {Neg}, {alpha} * (  {Neg} - V(Vc)  ), 0 )
R2 Vc 0 1000Meg
C3 N002 0 1p
R3 N002 N001 10k
E1 N001 0 Vi_lim 0 1
B3 Vi_lim 0 V= limit(  V(Vi), {Neg}, {Pos}  )
R4 Vi 0 10Meg
.param alpha = 5m
.param R_comp =1k
.param C_comp = 1n
.param C_comp2 = 1p
* B1
* B2
* Drawn : Mark Dimattina
* Title : Transconductance Error Amp
* Rev: 0.04
* Date: 25/07/2017
* M.J.Dimattina@ieee.org
.param Pos = 4
.param Neg = 0
.param Vref = 2.5
.param Gain = 135u
.ends transconerroramp

.subckt idealboost Vc a c p
H1 N001 0 V1 1
V1 c Sw 0
R5 I_sense N001 100
C2 I_sense 0 100p
A1 set trip_reset 0 0 0 q_bar q 0 SRFLOP
V2 set 0 PULSE(0 1 0 {Trise_fall} {Trise_fall} {Ton_min} {Period})
V3 reset 0 PULSE(0 1 {Ton_max} {Trise_fall} {Trise_fall} {Trise_fall} {Period} )
H2 N002 0 V5 1
R8 N003 N002 100
C5 N003 0 100n
V4 ramp 0 PULSE(0 {slopeAmp} 0 {Period - 2*Trise_fall} {Trise_fall} {Trise_fall} {Period})
B1 sense_slope 0 V={Ri}*V(I_sense) + V(ramp)
V5 Sw N004 0
R10 I_out N003 1000
C7 I_out 0 10n
A2 0 reset 0 trip2 0 0 trip_reset 0 OR
B2 N005 0 V=if( V(sense_slope) > V(Vc), 1, 0)
R11 trip N005 100
C8 trip 0 10p
B3 FET_R 0 V=if( V(q) > 0.5, {Rfet}, 1meg )
R2 N004 p R=V(Rdiode)
B4 Rdiode 0 V= if( V(Sw) > V(p), 10m, 100k )
B5 trip2 0 V=  V(trip) - V(set)
V6 On_time_ramp 0 PULSE(0 {1} 0 {Period - 2*Trise_fall} {Trise_fall} {Trise_fall} {Period})
B6 On_time 0 V=if( V(q) > 0.5, V(On_time_ramp), 0 )
R1 Sw a R = V(FET_R)
* TransconErrorAmp
.param Period = {1/Fs}
.param Trise_fall = 1n
.param Ton_min = {D_min * Period }
.param Ton_max = {D_max * Period}
.param Rfet = 1m
.param Fs = 100k
.param D_max = 90
.param D_min = 5
.param slopeAmp = 0.8
.param Ri = 0.25
* Drawn : Mark Dimattina
* Title : IdealBoost
* Rev: 0.04
* Date: 25/07/2017
* M.J.Dimattina@ieee.org
.ends idealboost

.subckt boost_cm3 Vc A C P
Bin A P I=  V(I_mag)
Bout A C I= V(I_demag)
XX1 Vc N001 N002 I_mag I_demag pwm_cm3 params: sync = {sync}, L = {L}, Fs = {Fs}, Ri = {Ri} , SlopeAmp = {SlopeAmp}, D_min = {D_min}, D_max = {D_max}
B1 N001 0 V= V(a, p)
B2 N002 0 V= V(c, a)
.param L = 10u
.param Fs = 200k
.param D_min = 0.05
.param D_max = 0.90
.param SlopeAmp =0.2
.param Ri = 0.25
.param sync = 0
* Drawn : Mark Dimattina
* Title : Boost CM3
* Rev: 0.01
* Date: 16/05/2024
* M.J.Dimattina@ieee.org
* Boost
.ends boost_cm3

.subckt pwm_cm3 Vc V_mag V_demag I_mag I_demag
R3 Vc 0 1G
B6 I_Pk_min 0 V=  V(mag) * {D_min / (Fs * L ) }
B10 I_pk 0 V=  max( V(I_pk_raw), V(I_pk_min)  )
B26 I_pk_raw 0 V=  ( V(Vc) - {SlopeAmp} * V(don_2) ) / {Ri}
B21 Don_0 0 V = {Fs * L} * V(I_pk) / V(mag)
B11 Doff_0 0 V = {Fs * L} * V(I_pk) / (V(demag) + 1u)
B12 N005 0 V= if (  V(CCM_test)  > 1 , 1, 0  )
R7 CCM_raw N005 {100*R_lp}
C2 CCM_raw 0 10p
B14 Don_1 0 V= limit( V(demag) / ( V(mag) + V(demag)  ), {D_min}, {D_max} )
B15 Doff_1 0 V=  1- V(Don_1)
B16 N003 0 V= limit(  min( V(Don_1), V(Don_0)  ),  {D_min}, {D_max} )
R17 Don_2 N003 {1*R_lp}
C10 Don_2 0 10p
B18 N004 0 V = min (  V(Doff_1), V(Doff_0)  )
R18 Doff_2 N004 {1*R_lp}
C11 Doff_2 0 10p
B23 delta_I_demag 0 V= V(demag) * V(Doff_2) / {L * Fs}
B24 I_min_mag 0 V= V(I_pk) - V(delta_I_mag)
B25 delta_I_mag 0 V= V(mag) * V(Don_2) / {L * Fs}
B28 I_mag 0 V= ( V(I_min_mag) + V(delta_I_mag)/2  ) * V(Don_2)
B29 I_demag 0 V= ( V(I_pk) - V(delta_I_mag)/2  ) * V(Doff_2)
B30 I_min_demag 0 V= V(I_pk) - V(delta_I_mag)
Cs1 CCM_Ind_V P001 { Cs }
L1 CCM_Ind_V 0 {L} Rser=0.1u
B5 N001 0 V=  V(V_mag) - V(Ind_V)
R11 mag N001 {1 * R_lp}
C4 mag 0 10p
V1 N008 0 {Cs}
B4 Ind_V 0 V= limit( V(CCM_Ind_V), -1*V(V_demag) + 1m, (V(V_mag) - 1m) )
B20 N002 0 V=  V(V_demag) + V(Ind_V)
R13 demag N002 {R_lp}
C8 demag 0 10p
B7 CCM_test 0 V= limit( V(Don_0) + V(Doff_0), 0, 2)
B13 N006 0 V= if( sync > 0.5, 1, if( V(CCM_test) > 1,  V(tst1), V(tst2) )  )
B19 tst1 0 V= if( V(CCM_raw) > 0.9, 1, 0 )
B27 tst2 0 V= if( V(CCM_raw) < 0.1, 0, 1 )
R1 CCM N006 {10*R_lp}
C5 CCM 0 10p
B32 0 CCM_Ind_V I = V(I_min_mag)
Rs1 P001 0 R = V(Rs)
B1 N007 0 V= if( V(CCM) > 0.5, {Rs_CCM}, {Rs_DCM}  )
B2 N009 0 V= V(Rs)
R2 Rs N007 {100*R_lp}
C1 Rs 0 10p
.param R_lp = 0.1meg/Fs
.param L = 10u
.param Fs = 200k
.param D_min = 0.05
.param D_max = 0.90
.param SlopeAmp =0.2
.param Ri = 0.25
.param sync = 0
* Drawn : Mark Dimattina
* Title : PWM-CM3
* Rev: 0.02
* Date:10/06/2024
* M.J.Dimattina@ieee.org
.param Cs = { 1 / ( L * (pi * Fs)**2 ) }
* Peak Current
* V = L di/dt
* dt = L * di / V
* delta I   during demag
* di =V * dt /  L
* delta I   during mag
* Magentizing Current
* De-magentizing Current
* On Time Duty Cycle
* Off Time Duty Cycle
* When Don + Doff > 1
* Don_1 = Don_0 / ( Don_0 + Doff_0 )
* simplifies to ->
* DCM
* CCM
* Mode Toggle
* Mode Selection
* Current Calculation
* Induced Inductor Voltage
* Peak Current
* Hysteresis to improve transient simulation speed
* Inductor Voltage
* Mag / Demag
.param Rs_CCM = { sqrt( L / Cs ) / Q }
.param Q = 10
.param Rs_DCM = { sqrt( L / Cs ) / 0.5 }
.ends pwm_cm3

.subckt pwm_bu vc a c p
B1 a N001 I= V(d1) / ( V(d1) + V(d2) ) * I(Vsense)
Vsense N001 c 0
B2 N001 p V= V(d1) / ( V(d1) + V(d2) + 1u ) * V(a,p)
CR c p Q = ( if( V(cm_ccm_ac) > 0.5, 4/ ( {L} * (2* pi *{f})**2 ), 0) ) * x
B3 0 d2 I= limit( abs( 2*L*f*(I(Vsense) ) / (V(d1)*V(a,c) + 10u ) - V(d1) ), 1-V(d1), 0 )
C1 d2 0 1p
R1 d2 0 1
R2 vc 0 1g
B4 dccm 0 V= limit(   2*f*L* ( V(vc) - ks*abs( I(Vsense) ) ) / ( 2*vr*f*L + ks * abs(V(a,c) )   ), 0, 1 )
B5 ddcm 0 V= limit(  V(vc) * L * f / ( vr*f*L + ks * abs(V(a,c) )   ), 0, 1 )
B6 d 0 V= min( V(ddcm), V(dccm) )
B7 0 d1 I= limit( V(d), {D_min}, {D_max} )
C2 d1 0 1p
R3 d1 0 1
B8 cm_ccm_ac 0 V= smallsig() * if( ({ks}>10u) & ( V(dccm)<V(ddcm) ), 1, 0 )
B9 mode 0 V= if( V(dccm) < V(ddcm), 1, 0)
.param f 100k
.param L 50u
.param ks 0
.param vr 1
.param D_min 0.01
.param D_max 0.99
* V= smallsig() * if( ({ks}>10u) & ( V(dccm)<V(ddcm) ), 1, 0 )
* Q = ( if( V(cm_ccm_ac) > 0.5, 4/ ( {L} * (2* pi *{f})**2 ), 0) ) * x
.ends pwm_bu

* .ac oct 100 10 10meg
.param L = 3.6u
.param Fs = 1240k
.param D_lo = {80n * Fs}
.param D_hi = 0.9
.param SlopeAmp = 0.8
* Duty Cycle Limits
* IC Parameters
.param Vout = 13.6
.param Cbulk = {4.7u *3}
.param Cesr = 1m
.param Vin = 5
.param Lesr = 10m
.param Rsense = 250m
.param Rdiv2 = 10k
.param Rdiv1 = Rdiv2 * (Vout - Vref) / Vref
.param Vref = 1.24
* TA Parameters
.param TA_Rcomp = 56k
.param TA_Ccomp = 330p
.param TA_Ccomp2 = 1p
.param TA_Gain = 135u
.param TA_compMax = 2.4
.param TA_compMin = 1m
.param I_step = 30mA
.param I_idle = 500mA
.param R_idle = Vout / I_idle
.param loadRiseFall = 1u
.param Rspeed = 10meg
.param Cspeed = 1p
.param Vc = 0.935
* Circuit Parameters
.param R_step = Vout / I_step
.ic V(out) = {Vout}
.ic V(Vi) = {Vref}
* Load Parameters
.ic V(Vc) = Vc
* .step param Vout 8 12 4
* .step param I_idle 30m 500m 470m
* Drawn : Mark Dimattina
* Title : Boost_RT9297
* Rev: 0.01
* Date: 02/09/2017
* M.J.Dimattina@ieee.org
* .step param SlopeAmp 0.4 2 0.4
.tran 0 2m 0
.backanno
.end